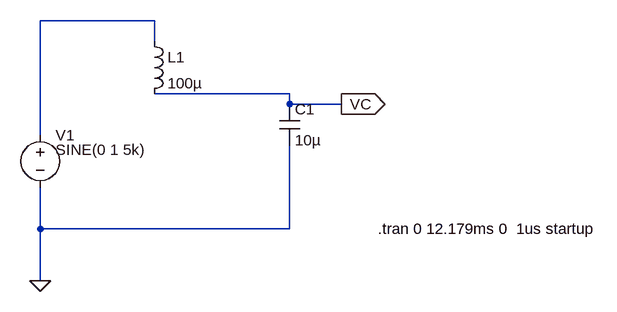
[diagram p0: schematic Draft1.asc]
Draft1.asc, the LTspice schematic file:
Version 4
SHEET 1 1440 680
WIRE 432 112 256 112
WIRE 432 144 432 112
WIRE 640 224 432 224
WIRE 640 240 640 224
WIRE 720 240 640 240
WIRE 640 256 640 240
WIRE 256 288 256 112
WIRE 256 432 256 368
WIRE 640 432 640 304
WIRE 640 432 256 432
WIRE 256 512 256 432
FLAG 720 240 VC
IOPIN 720 240 Out
FLAG 256 512 0
SYMBOL voltage 256 272 R0
WINDOW 3 24 38 Left 2
SYMATTR InstName V1
SYMATTR Value SINE(0 1 5k)
SYMATTR Value2 AC 1 0
SYMBOL ind 416 128 R0
SYMATTR InstName L1
SYMATTR Value 100µ
SYMATTR SpiceLine Ipk=1 Rser=85m Rpar=infin. Cpar=0 mfg="Coiltronics" pn="CTX100-1-52"
SYMBOL cap 624 240 R0
SYMATTR InstName C1
SYMATTR Value 10µ
TEXT 776 432 Left 2 !.tran 0 12.179ms 0  1us startup

The netlist it stands for:
* Draft1.asc
V1 N001 0 SINE(0 1 5k) AC 1 0
L1 N001 VC 100µ Ipk=1 Rser=85m Rpar=infin. Cpar=0 mfg="Coiltronics" pn="CTX100-1-52"
C1 VC 0 10µ
.tran 0 12.179ms 0  1us startup
.backanno
.end